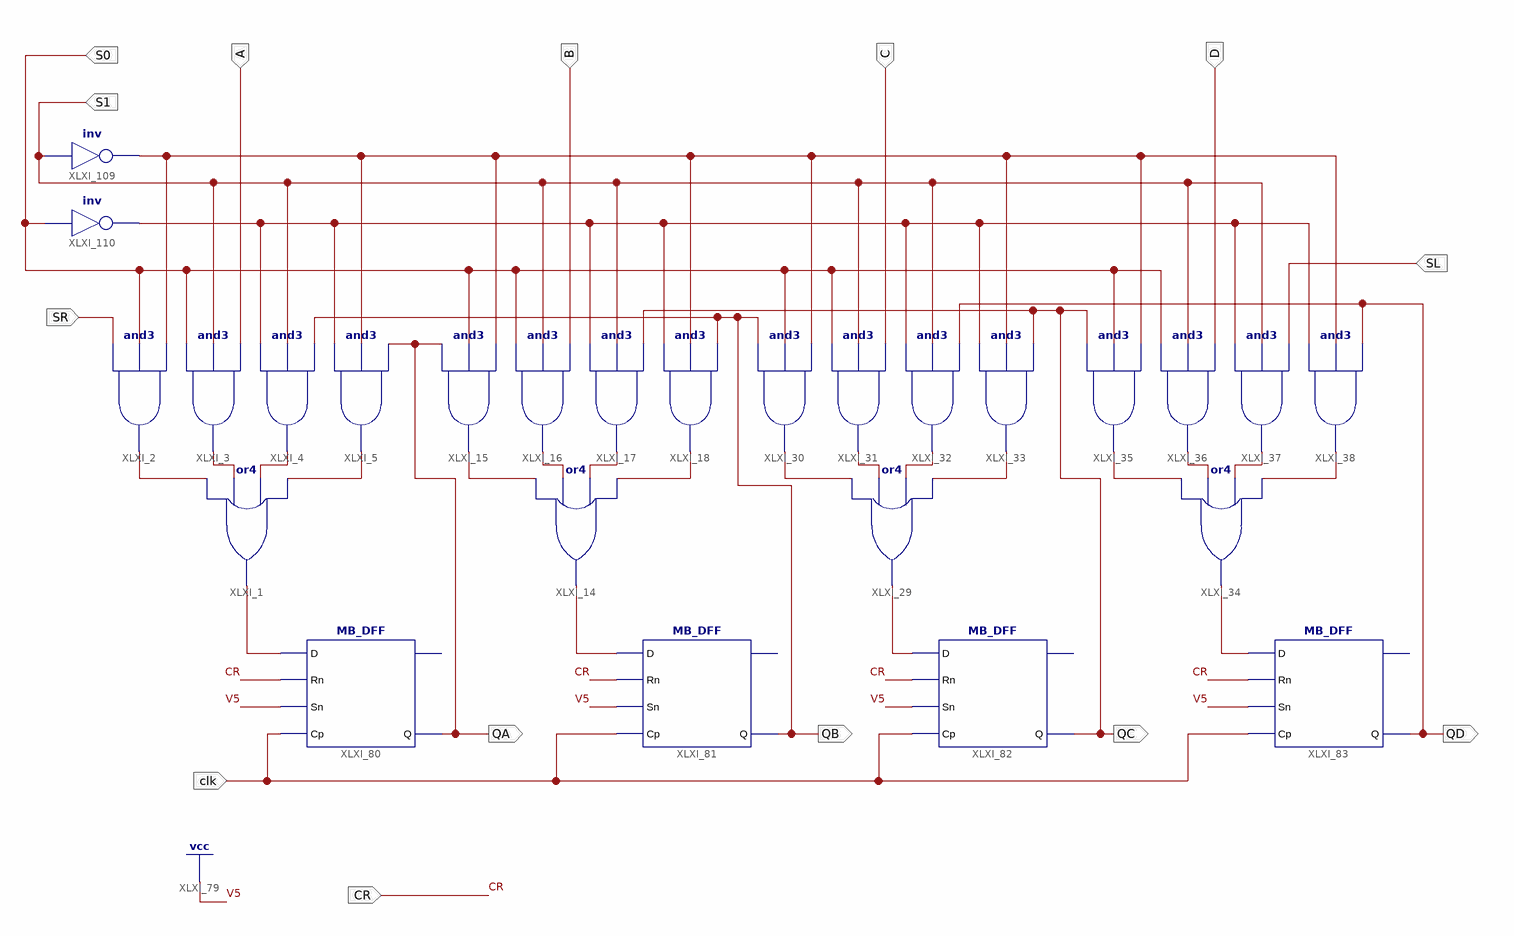
[diagram p0: schematic sheet 1]
// Xilinx ISE schematic DM74LS194.sch (kintex7) as structural Verilog: 26 symbols, 14 ports
module DM74LS194 (
  input  CR,
  input  clk,
  input  SL,
  input  SR,
  input  A,
  input  B,
  input  C,
  input  D,
  input  S1,
  input  S0,
  output QA,
  output QB,
  output QC,
  output QD
);

  wire XLXN_1, XLXN_2, XLXN_3, XLXN_4, XLXN_5, XLXN_6, XLXN_7, XLXN_8, XLXN_17, XLXN_18, XLXN_19, XLXN_20,
       XLXN_21, XLXN_22, XLXN_23, XLXN_24, XLXN_83, XLXN_84, XLXN_85, XLXN_86, XLXN_157, XLXN_159;

  or XLXI_1 (XLXN_83, XLXN_1, XLXN_2, XLXN_3, XLXN_4);
  and XLXI_2 (XLXN_1, SR, S0, XLXN_157);
  and XLXI_3 (XLXN_2, S0, S1, A);
  and XLXI_4 (XLXN_3, XLXN_159, S1, QB);
  and XLXI_5 (XLXN_4, XLXN_159, XLXN_157, QA);
  or XLXI_14 (XLXN_84, XLXN_5, XLXN_6, XLXN_7, XLXN_8);
  and XLXI_15 (XLXN_5, QA, S0, XLXN_157);
  and XLXI_16 (XLXN_6, S0, S1, B);
  and XLXI_17 (XLXN_7, XLXN_159, S1, QC);
  and XLXI_18 (XLXN_8, XLXN_159, XLXN_157, QB);
  or XLXI_29 (XLXN_85, XLXN_17, XLXN_18, XLXN_19, XLXN_20);
  and XLXI_30 (XLXN_17, QB, S0, XLXN_157);
  and XLXI_31 (XLXN_18, S0, S1, C);
  and XLXI_32 (XLXN_19, XLXN_159, S1, QD);
  and XLXI_33 (XLXN_20, XLXN_159, XLXN_157, QC);
  or XLXI_34 (XLXN_86, XLXN_21, XLXN_22, XLXN_23, XLXN_24);
  and XLXI_35 (XLXN_21, QC, S0, XLXN_157);
  and XLXI_36 (XLXN_22, S0, S1, D);
  and XLXI_37 (XLXN_23, XLXN_159, S1, SL);
  and XLXI_38 (XLXN_24, XLXN_159, XLXN_157, QD);
  MB_DFF XLXI_80 (.D(XLXN_83), .Rn(CR), .Sn(1'b1), .Cp(clk), .Q(QA));  // open: Qn
  MB_DFF XLXI_81 (.D(XLXN_84), .Rn(CR), .Sn(1'b1), .Cp(clk), .Q(QB));  // open: Qn
  MB_DFF XLXI_82 (.D(XLXN_85), .Rn(CR), .Sn(1'b1), .Cp(clk), .Q(QC));  // open: Qn
  MB_DFF XLXI_83 (.D(XLXN_86), .Rn(CR), .Sn(1'b1), .Cp(clk), .Q(QD));  // open: Qn
  not XLXI_109 (XLXN_157, S1);
  not XLXI_110 (XLXN_159, S0);
endmodule
